# EAGLE design PolarStormControlBoard_smol_275_gnd (EAGLE 8.2.2)
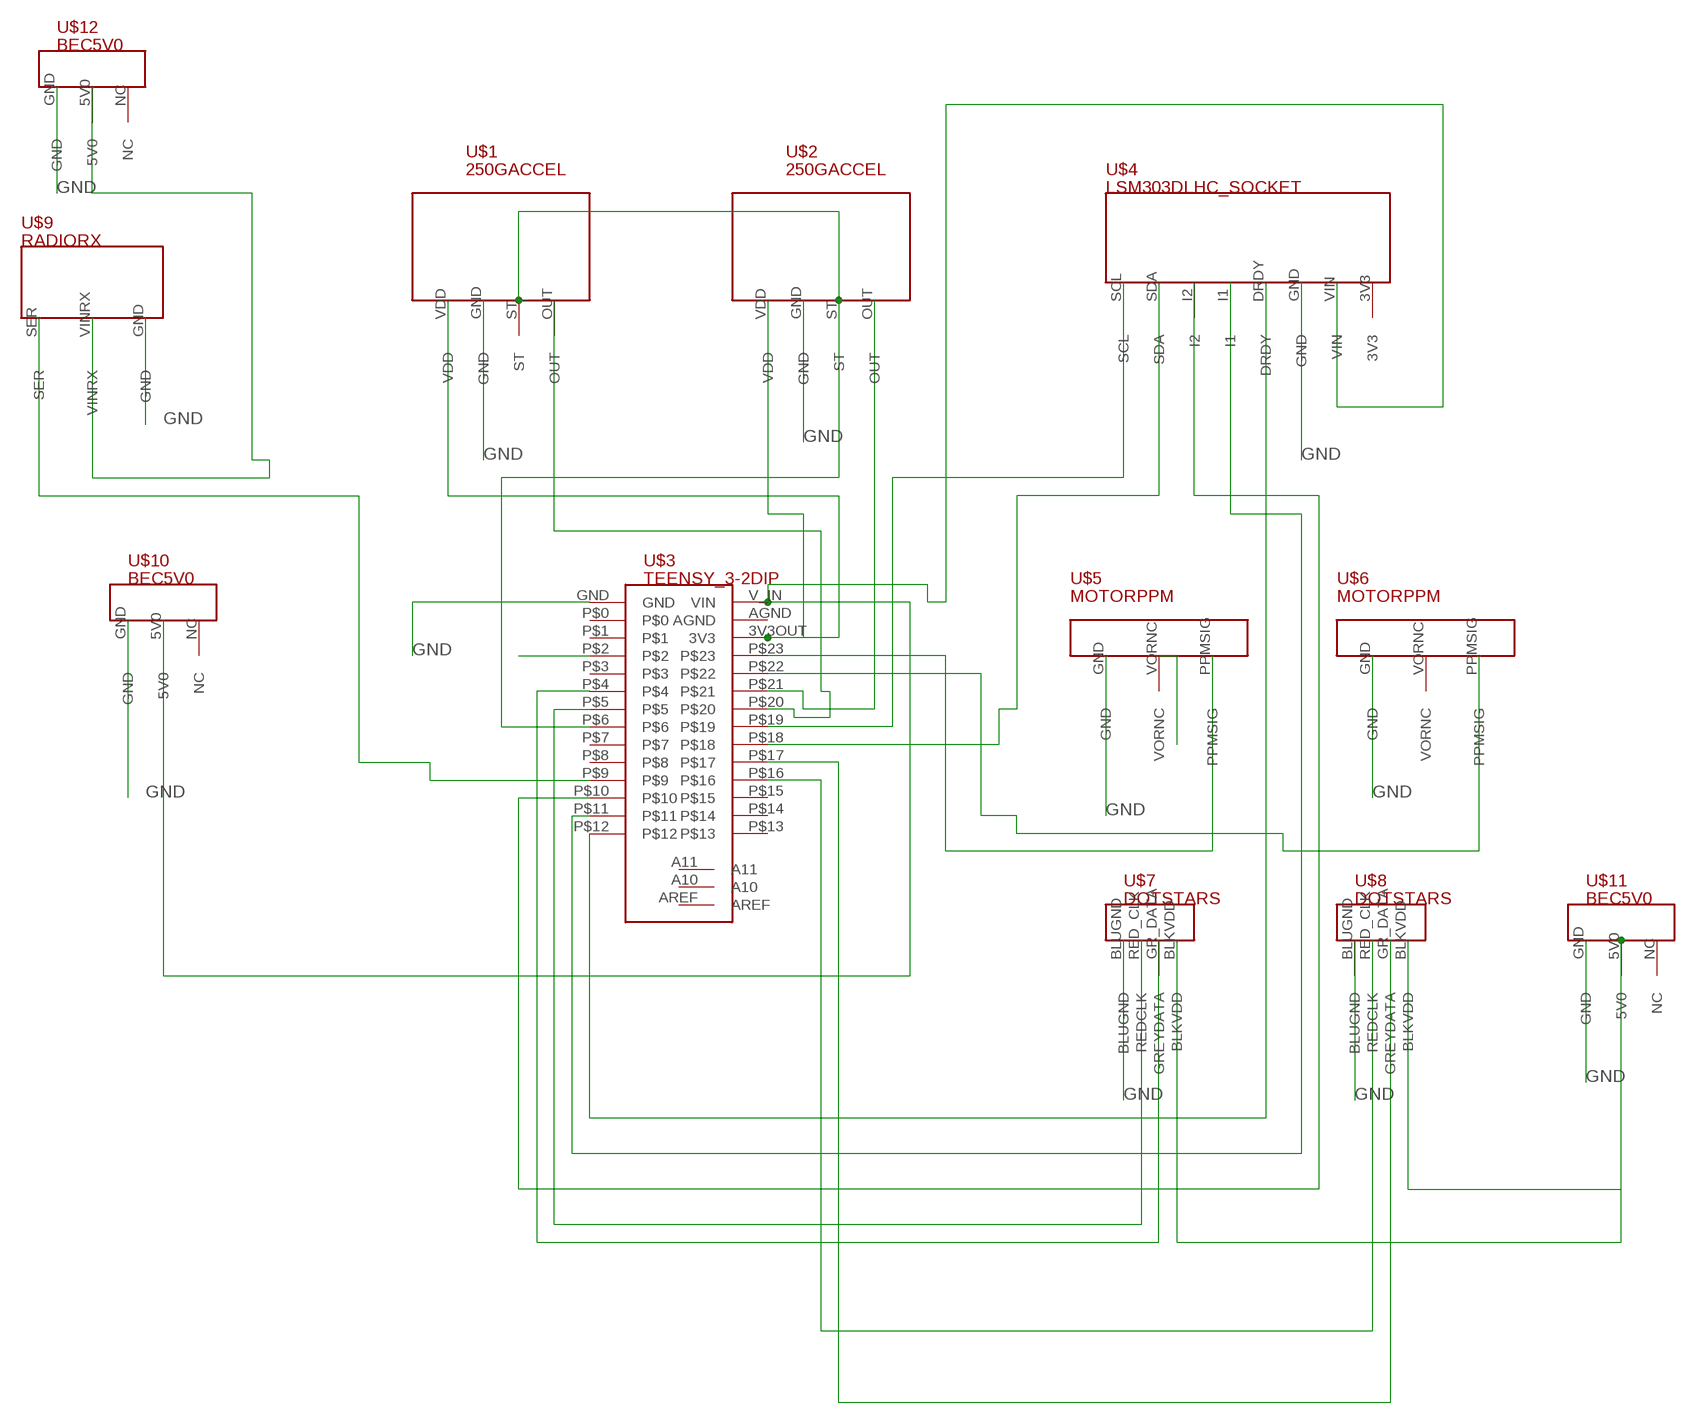
[diagram p0: schematic, sheet 1]

## Parts
U$1  250GACCEL  [250GACCEL]
U$2  250GACCEL  [250GACCEL]
U$3  TEENSY_3-2DIP  [TEENSY_3_2_SOCKET]
U$4  LSM303DLHC_SOCKET  [LSM303DLHC_SOCKET]
U$5  MOTORPPM  [MOTORINTERFACE]
U$6  MOTORPPM  [MOTORINTERFACE]
U$7  DOTSTARS  [DOTSTARHEADER]
U$8  DOTSTARS  [DOTSTARHEADER]
U$9  RADIORX  [SERIALRX]
U$10  BEC5V0  [BECIN]
U$11  BEC5V0  [BECIN]
U$12  BEC5V0  [BECIN]

## Nets
GND: U$1.GND U$2.GND U$3.GND U$4.GND U$5.GND U$6.GND U$7.BLUGND U$8.BLUGND U$9.GND U$10.GND U$11.GND U$12.GND
N$1: U$2.OUT U$3.P$21
N$2: U$1.OUT U$3.P$20
N$3: U$3.P$2
N$4NC: U$5.VORNC
N$5: U$1.VDD U$2.VDD U$3.3V3OUT(3V3)
N$6: U$9.VINRX U$12.5V0
N$7: U$3.P$23 U$5.PPMSIG
N$8: U$3.P$22 U$6.PPMSIG
N$9: U$3.P$9 U$9.SER
N$10: U$7.BLKVDD U$8.BLKVDD U$11.5V0
N$11: U$3.V_IN(VIN) U$4.VIN U$10.5V0
N$12: U$3.P$5 U$7.RED_CLK(REDCLK)
N$13: U$3.P$4 U$7.GR_DATA(GREYDATA)
N$14: U$3.P$16 U$8.RED_CLK(REDCLK)
N$15: U$3.P$17 U$8.GR_DATA(GREYDATA)
N$16: U$3.P$19 U$4.SCL
N$17: U$3.P$18 U$4.SDA
N$18: U$3.P$12 U$4.DRDY
N$19: U$3.P$11 U$4.I1
N$20: U$1.ST U$2.ST U$3.P$6
N$21: U$3.P$10 U$4.I2
Unconnected: U$3.A10 U$3.A11 U$3.AGND U$3.AREF U$3.P$0 U$3.P$1 U$3.P$3 U$3.P$7 U$3.P$8 U$3.P$13 U$3.P$14 U$3.P$15 U$10.NC U$11.NC U$12.NC

## Power pins joined to a net without a drawn wire
3V3: U$4.3V3
VORNC: U$6.VORNC

## Library data of the parts
U$1 U$2 = 250GAccel:250GACCEL: layout of 250G accelerometer
U$3 = teensy_3_2_0:TEENSY_3-2: Socket for the teensy 3.2 microcontroller
U$4 = LSM303DLHC:LSM303DLHC_SOCKET: magnetometer/accelerometer
U$5 U$6 = MOTORPPMHEADER:MOTORPPM: VESC PPM Interface
U$7 U$8 = DotStarHeader:DOTSTARS: header for adafruit dotstars
U$9 = ReceiverPinout:RADIORX: Reciever for polarmelt
U$10-U$12 = BECHeader:BEC5V0: Buck Converter output for Polar Storm Ckts

## Board
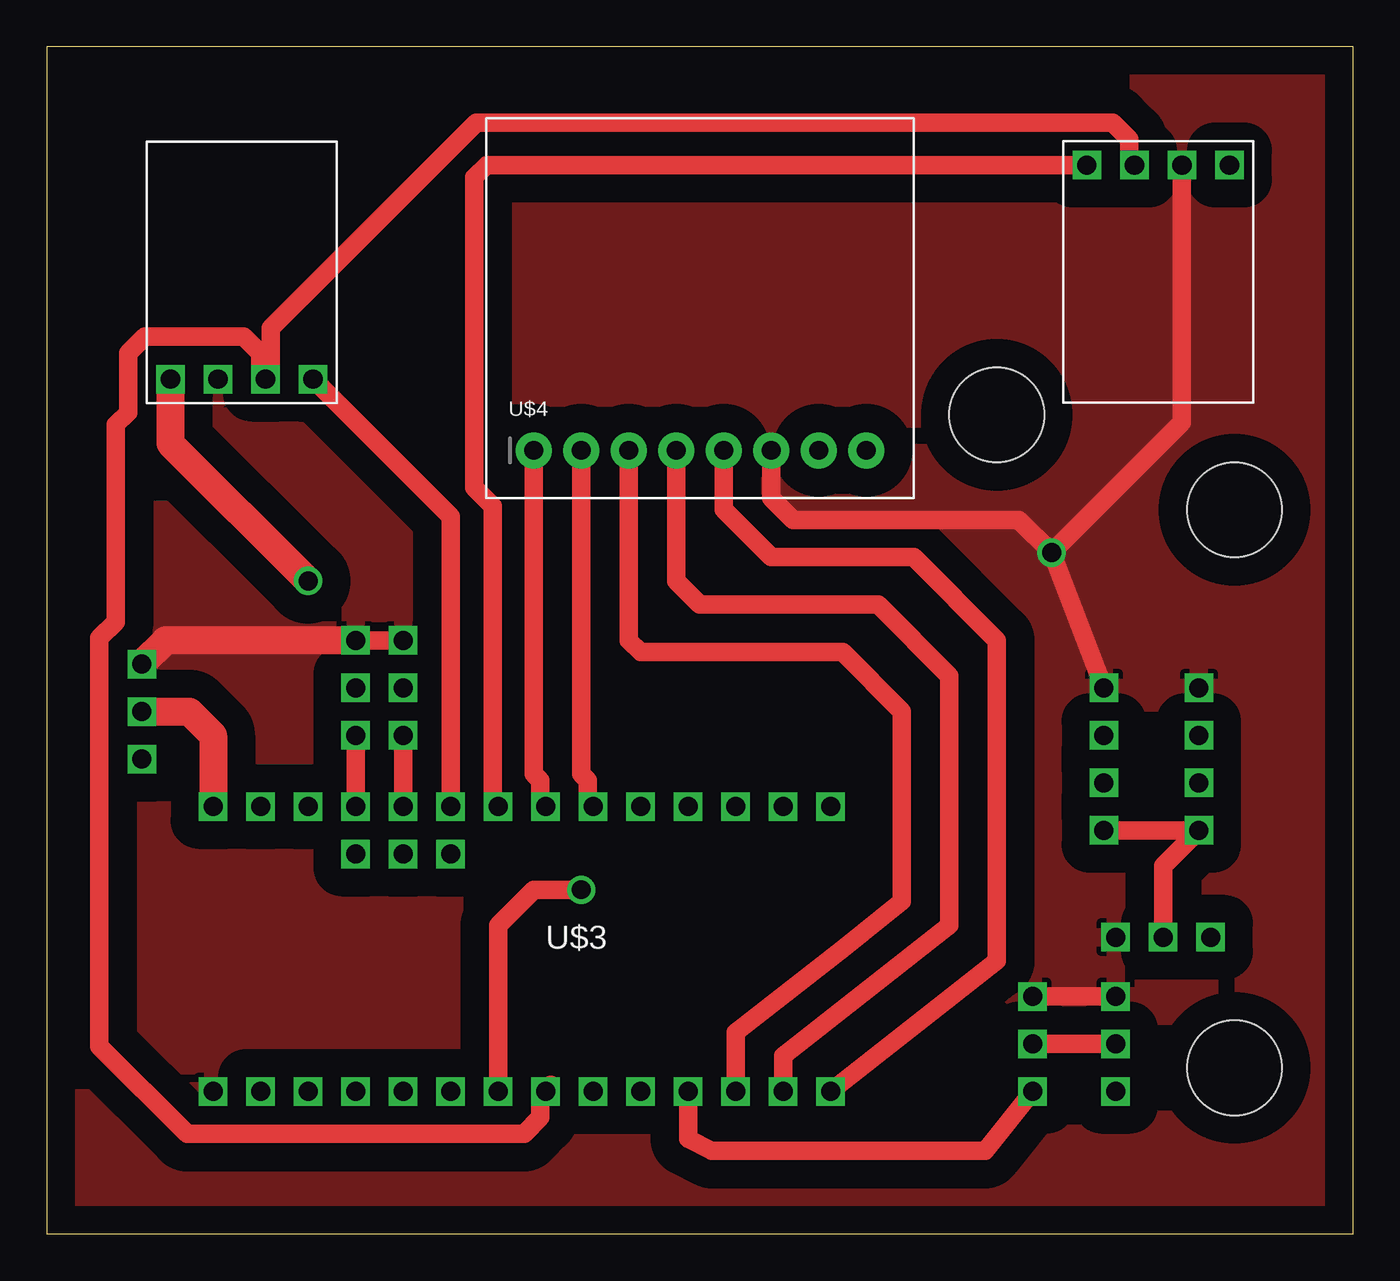
[diagram p1: board, top side]
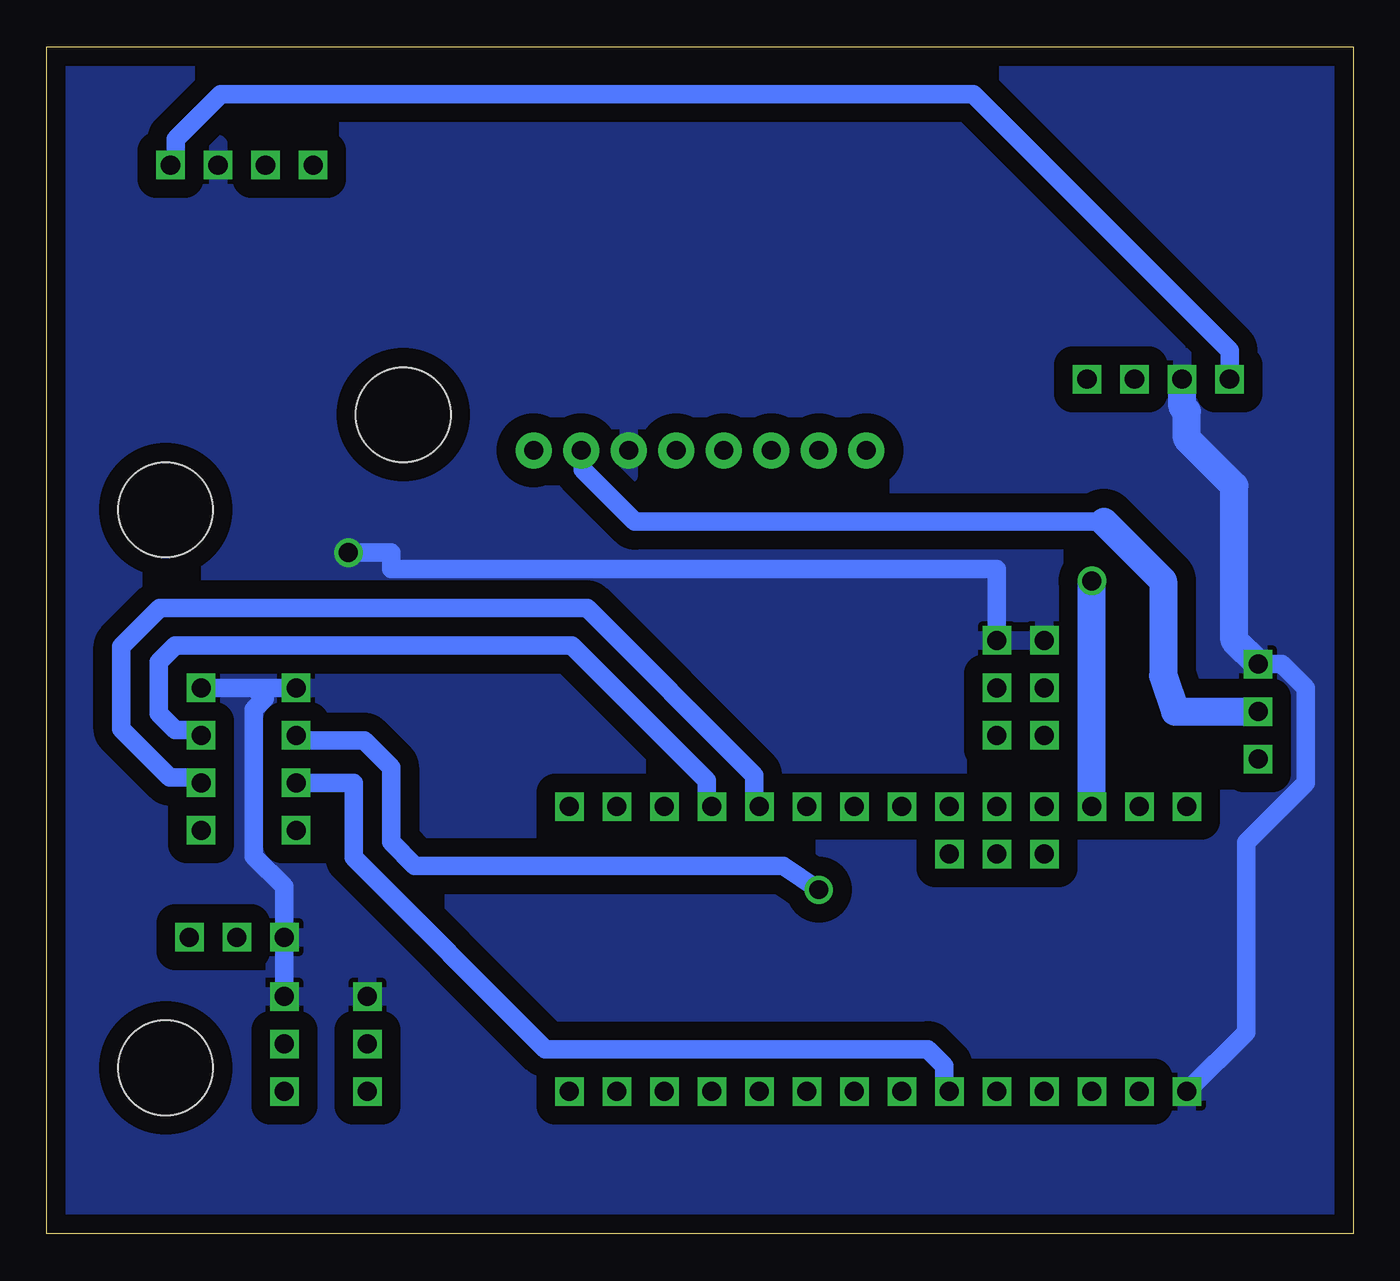
[diagram p2: board, bottom side, seen from below]

Size 69.85 x 63.5 mm. Coordinates in mm from the lower left corner, seen from the top.
Outline: 0,0 69.85,0 69.85,63.5 0,63.5 0,0
Copper layers (1*16): Top 0.035mm / dielectric 1.5mm / Bottom 0.035mm
Design rules "default *": minimum track width 6mil, minimum drill 0.35mm, track to track 1mm, track to pad 1mm, pad to pad 24mil, via to via 24mil, smd to smd 24mil, copper to edge 40mil, drill to drill 6mil, minimum pad ring 10mil, minimum via ring 8mil, stop-mask expansion 4mil, vias tented up to drill 0mil, thermal gap 10mil
Holes 5.08 mm at 63.5,8.89 63.5,38.73 50.8,43.81

### Footprints (pad centres in the part's own frame; a part is rotated, then mirrored left to right if it is on the bottom)
250GACCEL = drill 1.02 square: GND -1.27,2.54; OUT 3.81,2.54; ST 1.27,2.54; VDD -3.81,2.54
TEENSY_3_2_SOCKET = drill 1.02 square: 3V3OUT -12.7,7.62; A10 -7.62,5.08; A11 -5.08,5.08; AGND -15.24,7.62; AREF -10.16,5.08; GND -17.78,-7.62; P$0 -15.24,-7.62; P$1 -12.7,-7.62; P$2 -10.16,-7.62; P$3 -7.62,-7.62; P$4 -5.08,-7.62; P$5 -2.54,-7.62; P$6 0,-7.62; P$7 2.54,-7.62; P$8 5.08,-7.62; P$9 7.62,-7.62; P$10 10.16,-7.62; P$11 12.7,-7.62; P$12 15.24,-7.62; P$13 15.24,7.62; P$14 12.7,7.62; P$15 10.16,7.62; P$16 7.62,7.62; P$17 5.08,7.62; P$18 2.54,7.62; P$19 0,7.62; P$20 -2.54,7.62; P$21 -5.08,7.62; P$22 -7.62,7.62; P$23 -10.16,7.62; V_IN -17.78,7.62
LSM303DLHC_SOCKET = drill 1 pad 1.93: 3V3 8.89,-3.81; DRDY 1.27,-3.81; GND 3.81,-3.81; I1 -1.27,-3.81; I2 -3.81,-3.81; SCL -8.89,-3.81; SDA -6.35,-3.81; VIN 6.35,-3.81
MOTORINTERFACE = drill 1.016 square: GND -2.54,0; PPMSIG 2.54,0; VORNC 0,0
DOTSTARHEADER = drill 1.016 square: BLKVDD 3.81,0; BLUGND -3.81,0; GR_DATA 1.27,0; RED_CLK -1.27,0
SERIALRX = drill 1.016 square: GND 2.54,0; SER -2.54,0; VINRX 0,0
BECIN = drill 1.016 square: 5V0 0,0; GND -2.54,0; NC 2.54,0

### Placement (x,y rotation side)
U$1  59.42,59.72 180 top
U$2  10.43,43.18 0 top
U$3  26.67,15.24 0 top
U$4  34.92,45.72 0 top
U$5  16.51,29.21 270 top
U$6  19.05,29.21 270 top
U$7  56.52,25.4 270 top
U$8  61.59,25.4 270 top
U$9  52.7,10.16 90 top
U$10  5.08,27.94 270 top
U$11  59.69,15.88 0 top
U$12  57.15,10.16 270 top

### Tracks (layer width: path | path; a pad name or v marks a point on that pad's centre or on a via)
GND  (via drill 1.02)
  Top 1: U$5.GND U$6.GND | U$9.GND U$12.GND | v53.73,36.44 51.98,38.2 39.91,38.2 38.73,39.37 U$4.GND | U$7.BLUGND v53.73,36.44 | U$1.GND 60.69,43.4 v53.73,36.44
  Top 1.499: U$5.GND 6.35,31.75 U$10.GND
  Bottom 1: U$10.GND 3.81,30.48 2.54,29.21 2.54,24.13 5.71,20.95 5.71,10.79 U$3.GND | U$6.GND 19.05,35.56 51.44,35.56 51.44,36.44 v53.73,36.44 | U$12.GND U$11.GND 57.15,18.58 58.78,20.21 58.78,28.05 58.19,28.64 58.76,29.21 | 58.76,29.21 U$8.BLUGND | 58.76,29.21 U$7.BLUGND
  Bottom 1.5: U$10.GND 6.35,31.75 6.35,40.01 8.89,42.55 8.89,43.99 9.13,44.23 9.13,45.7 U$2.GND
  pour Bottom (isolate 1): 0,0 0,63.5 69.85,63.5 69.85,0
  pour Top (isolate 1.5): 0,0 0,63.5 69.85,63.5 69.85,0
N$1
  Top 1: U$3.P$21 21.59,38.37 U$2.OUT
N$2
  Top 1: U$1.OUT 23.52,57.17 22.86,56.52 22.86,39.92 23.86,38.93 23.86,23.14 U$3.P$20
N$5  (via drill 1.02)
  Top 1.5: U$2.VDD 6.62,42.28 v13.97,34.92
  Bottom 1: U$2.VDD 6.62,47.26 20.32,60.96 60.56,60.96 62.96,58.56 62.96,57.45 U$1.VDD
  Bottom 1.5: U$3.3V3OUT v13.97,34.92
N$6
  Top 1: U$9.VINRX U$12.5V0
N$7
  Top 1: U$5.PPMSIG U$3.P$23
N$8
  Top 1: U$6.PPMSIG U$3.P$22
N$9
  Top 1: U$9.SER 50.16,4.45 35.56,4.45 34.29,5.08 U$3.P$9
N$10
  Top 1: U$7.BLKVDD U$8.BLKVDD 59.69,19.68 U$11.5V0
N$11
  Top 1.5: U$10.5V0 7.62,27.94 8.89,26.67 U$3.V_IN
  Bottom 1: U$4.VIN 41.2,41.84 41.2,40.89 38.41,38.1 13.34,38.1
  Bottom 1.499: 13.34,38.1 10.16,34.92 10.16,29.84 9.53,27.94 U$10.5V0
N$12  (via drill 1)
  Top 1: U$3.P$5 24.13,16.51 26.04,18.41 v28.57,18.41
  Bottom 1: v28.57,18.41 30.48,19.68 50.16,19.68 51.44,20.96 51.44,24.96 52.87,26.39 56.24,26.39 U$7.RED_CLK
N$13
  Bottom 1: U$3.P$4 21.86,7.89 21.86,9.01 22.74,9.88 43.19,9.88 53.44,20.13 53.44,24.13 U$7.GR_DATA
N$14
  Bottom 1: U$3.P$16 34.56,23.14 34.56,24.25 41.79,31.47 62.98,31.47 63.86,30.59 63.86,27.83 62.98,26.95 61.87,26.95 U$8.RED_CLK
N$15
  Bottom 1: U$3.P$17 32.02,23.14 32.02,24.54 40.96,33.47 63.81,33.47 65.86,31.42 65.86,27 63.27,24.41 61.87,24.41 U$8.GR_DATA
N$16
  Top 1: U$4.SCL 26.04,24.61 26.39,24.25 26.39,23.14 U$3.P$19
N$17
  Top 1: U$4.SDA 28.57,24.61 28.93,24.25 28.93,23.14 U$3.P$18
N$18
  Top 1: U$3.P$12 50.8,14.61 50.8,31.75 46.35,36.2 38.73,36.2 36.2,38.73 U$4.DRDY
N$19
  Top 1: U$3.P$11 39.37,9.53 48.26,16.51 48.26,29.84 44.45,33.66 34.92,33.66 33.66,34.92 U$4.I1
N$20
  Top 1: U$3.P$6 26.95,7.89 26.95,7.98 26.39,7.43 26.39,6.23 25.52,5.36 7.5,5.36 2.82,10.04 2.82,29.1 2.82,31.86 3.7,32.74 3.7,43.28 4.35,43.93 4.35,47.11 5.23,47.98 10.54,47.98 11.42,47.11 11.42,45.99 U$2.ST 11.97,45.99 11.97,48.45 22.96,59.44 57,59.44 57.88,58.56 57.88,57.45 U$1.ST
N$21
  Top 1: U$3.P$10 36.83,10.79 42.55,15.24 45.72,17.78 45.72,27.94 42.55,31.11 31.75,31.11 31.11,31.75 U$4.I2